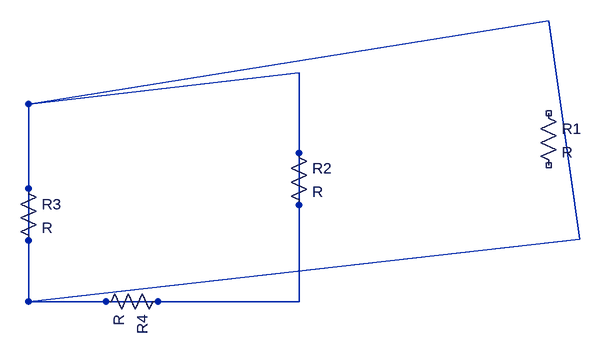
[diagram p0: schematic C33_D2_P3.jpg.asc]
C33_D2_P3.jpg.asc, the LTspice schematic file:
Version 4
SHEET 1 880 680
SYMBOL res 1200 222 R0
SYMATTR InstName R1
SYMBOL res 816 283 R0
SYMATTR InstName R2
SYMBOL res 400 338 R0
SYMATTR InstName R3
SYMBOL res 631 512 R90
SYMATTR InstName R4
WIRE 416 528 1264 432
WIRE 1216 96 1264 432
WIRE 416 224 832 176
WIRE 832 176 832 528
WIRE 416 224 416 528
WIRE 416 224 1216 96
WIRE 416 528 832 528

The netlist it stands for:
* C33_D2_P3.jpg.asc
R1 NC_01 NC_02 R
R2 N001 N001 R
R3 N001 N001 R
R4 N001 N001 R
.backanno
.end